# EAGLE schematic main (EAGLE 9.5.1)
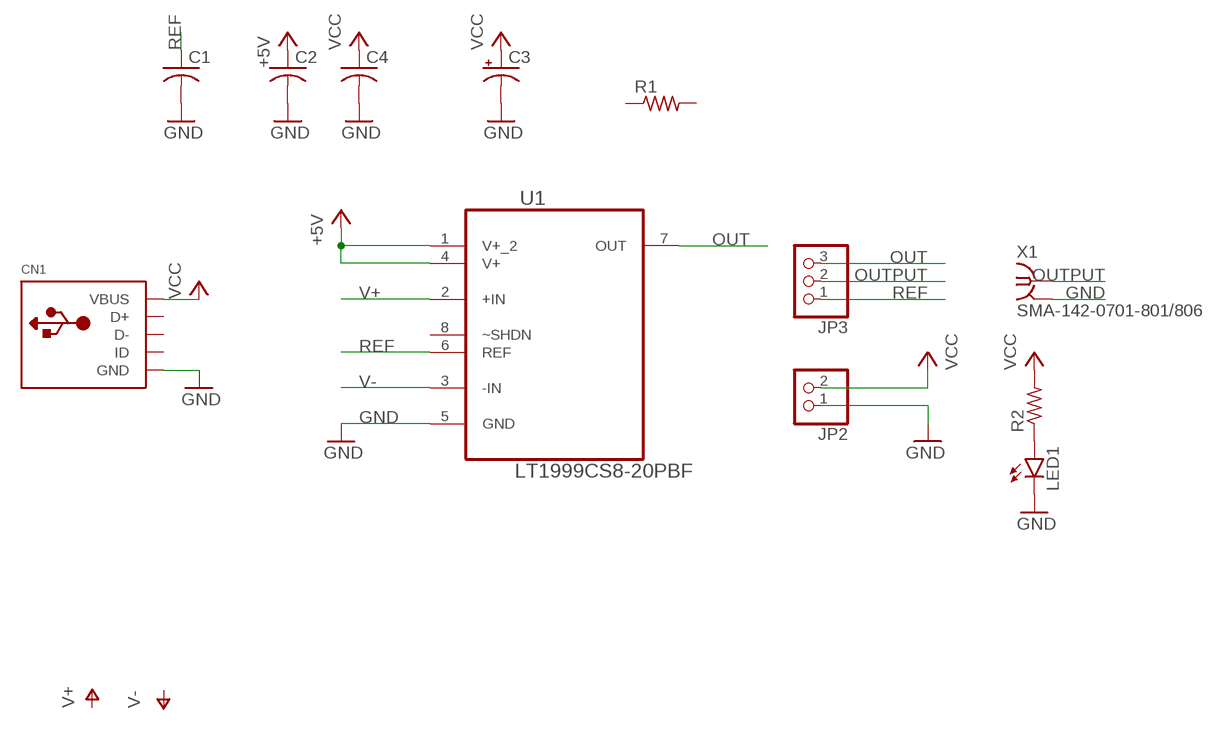
[diagram p0: schematic, sheet 1]

## Parts
C1  C-US050-030X075  [C050-030X075]
C2  C-US050-030X075  [C050-030X075]
C3  CPOL-USE2-5  [E2-5]
C4  C-US050-030X075  [C050-030X075]
CN1  USBMINIB  [USB-MINIB]
JP2  PINHD-1X2  [1X02]
JP3  PINHD-1X3  [1X03]
LED1  LEDCHIP-LED0603  [CHIP-LED0603]
R1  R-US_0204/7  [0204/7]
R2  R-US_R0603  [R0603]
U1  LT1999CS8-20PBF  [SOIC127P600X175-8N]
X1  SMA-142-0701-801/806  [J502-ND-142-0701-801/806]

## Nets
+5V: C2.1 U1.1(V+_2) U1.4(V+)
GND: C1.2 C2.2 C3.- C4.2 CN1.GND JP2.1 LED1.C U1.5(GND) X1.G@1 X1.G@2 X1.G@3 X1.G@4
N$1: LED1.A R2.1
OUT: JP3.3 U1.7(OUT)
OUTPUT: JP3.2 X1.1
REF: C1.1 JP3.1 U1.6(REF)
V+: U1.2(+IN)
V-: U1.3(-IN)
VCC: C3.+ C4.1 CN1.VBUS JP2.2 R2.2
Unconnected: CN1.D+ CN1.D- CN1.ID R1.1 R1.2 U1.8(~SHDN)

## Library data of the parts
C1 C2 C4 = rcl:C-US: CAPACITOR, American symbol; SPICEPREFIX: C
C3 = rcl:CPOL-US: POLARIZED CAPACITOR, American symbol; SPICEPREFIX: C
CN1 = adafruit:USB: USB Connectors USBMINIB - Surface Mount Female Mini-B USB Connector 4UConnector: 06564 By microbuilder.eu Thru-hole RA Female Mini-B USB Connector 4UConnector: 18732 By ladyada.net
JP2 = pinhead:PINHD-1X2: PIN HEADER
JP3 = pinhead:PINHD-1X3: PIN HEADER
LED1 = led:LED: LED OSRAM: - CHIPLED LG R971, LG N971, LY N971, LG Q971, LY Q971, LO R971, LY R971 LH N974, LH R974 LS Q976, LO Q976, LY Q976 LO Q996 - Hyper CHIPLED LW Q18S LB Q993, LB Q99A, LB R99A - SideLED LS A670, LO A670, LY A670, LG A670, LP A670 LB A673, LV A673, LT A673, LW A673 LH A674 LY A675 LS A676, LA A676, LO A676, LY A676, LW A676 LS A679, LY A679, LG A679 - Hyper Micro SIDELED® LS Y876, LA Y876, LO Y876, LY Y876 LT Y87S - SmartLED LW L88C, LW L88S LB L89C, LB L89S, LG L890 LS L89K, LO L89K, LY L89K LS L896, LA L896, LO L896, LY L896 - TOPLED LS T670, LO T670, LY T670, LG T670, LP T670 LSG T670, LSP T670, LSY T670, LOP T670, LYG T670 LG T671, LOG T671, LSG T671 LB T673, LV T673, LT T673, LW T673 LH T674 LS T676, LA T676, LO T676, LY T676, LB T676, LH T676, LSB T676, LW T676 LB T67C, LV T67C, LT T67C, LS T67K, LO T67K, LY T67K, LW E67C LS E67B, LA E67B, LO E67B, LY E67B, LB E67C, LV E67C, LT E67C LW T67C LS T679, LY T679, LG T679 LS T770, LO T770, LY T770, LG T770, LP T770 LB T773, LV T773, LT T773, LW T773 LH T774 LS E675, LA E675, LY E675, LS T675 LS T776, LA T776, LO T776, LY T776, LB T776 LHGB T686 LT T68C, LB T68C - Hyper Mini TOPLED® LB M676 - Mini TOPLED Santana® LG M470 LS M47K, LO M47K, LY M47K Source: http://www.osram.convergy.de LUXEON: - LUMILED® LXK2-PW12-R00, LXK2-PW12-S00, LXK2-PW14-U00, LXK2-PW14-V00 LXK2-PM12-R00, LXK2-PM12-S00, LXK2-PM14-U00 LXK2-PE12-Q00, LXK2-PE12-R00, LXK2-PE12-S00, LXK2-PE14-T00, LXK2-PE14-U00 LXK2-PB12-K00, LXK2-PB12-L00, LXK2-PB12-M00, LXK2-PB14-N00, LXK2-PB14-P00, LXK2-PB14-Q00 LXK2-PR12-L00, LXK2-PR12-M00, LXK2-PR14-Q00, LXK2-PR14-R00 LXK2-PD12-Q00, LXK2-PD12-R00, LXK2-PD12-S00 LXK2-PH12-R00, LXK2-PH12-S00 LXK2-PL12-P00, LXK2-PL12-Q00, LXK2-PL12-R00 Source: www.luxeon.com KINGBRIGHT: KA-3528ASYC Source: www.kingbright.com
R1 R2 = rcl:R-US_: RESISTOR, American symbol; SPICEPREFIX: R
U1 = LTC_By_element14_Batch_1:LT1999CS8-20PBF: High Voltage, Bidirectional Current Sense Amplifier; MPN: LT1999CS8-20#PBF; OC_FARNELL: 1868096; OC_NEWARK: 24T0470; PACKAGE: SOIC-8; SUPPLIER: LINEAR TECHNOLOGY
X1 = con-coax:SMA-: SMA 50 Ohm End Launch Jack Receptacle - Round Contact Johnson Components Source: www.johnsoncomponents.com .. J502-ND.pdf; MF: JOHNSON COMPONENTS; MPN: 142-0701-801; OC_FARNELL: 1608592; OC_NEWARK: 90F2624